# Altium schematic sheet daisy_chain_connectors.SchDoc
size A3; SheetNumber: 12; SheetTotal: 15; SheetDescription: Daisy-Chain Connectors
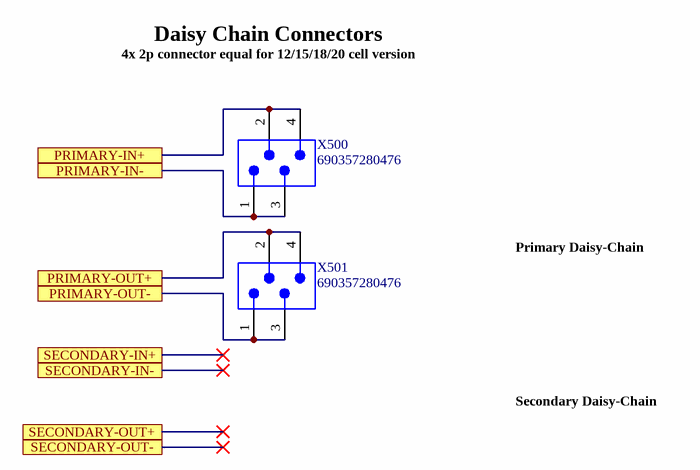
[diagram p0: daisy_chain_connectors.SchDoc]

## Parts
X500  690357280476  [690357280476]
X501  690357280476  [690357280476]

## Ports
PRIMARY-IN+, PRIMARY-IN-, PRIMARY-OUT+, PRIMARY-OUT-, SECONDARY-IN+, SECONDARY-IN-, SECONDARY-OUT+, SECONDARY-OUT-

## Nets
PRIMARY-IN+: X500.2 X500.4 ; port PRIMARY-IN+
PRIMARY-IN-: X500.1 X500.3 ; port PRIMARY-IN-
PRIMARY-OUT+: X501.2 X501.4 ; port PRIMARY-OUT+
PRIMARY-OUT-: X501.1 X501.3 ; port PRIMARY-OUT-

## Notes on the sheet
- Daisy Chain Connectors
- 4x 2p connector equal for 12/15/18/20 cell version
- Primary Daisy-Chain
- Secondary Daisy-Chain
- Fraunhofer IISB
- Schottkystr. 10
- developed by:
- 91058 Erlangen
- Germany
- Author
- Project
- License
- Description
- File
- Version
- Release Date
- Sheet
- foxbms.org <https://foxbms.org>
- www.iisb.fraunhofer.de <https://www.iisb.fraunhofer.de/>
- foxBMS Team
- /

## Library data of the parts
X500 X501 = CMP-1502-00889-2: NexarPartId: 8917647; Connector Type: Male Pin; Contact Resistance: 10mΩ; Pitch: 2.54mm; Insulation Resistance: 1GΩ; Number of Contacts: 4; Current Rating: 1.5A; Operating Supply Voltage: 100V; Gender: Male; Row Spacing: 1.4986mm; Orientation: Straight; Length: 5.91mm; RoHS: Compliant; Contact Plating: Tin; Contact Material: Bronze; Number of Positions: 4; Color: Red; Lead Pitch: 2.54mm; Number of Pins: 4; Packaging: Tape and Reel; Termination: Solder; Number of Rows: 2; REACH SVHC: Unknown; Max Operating Temperature: 105°C; Voltage Rating: 100V; Mount: Surface Mount; Fastening Type: Ramp; Min Operating Temperature: -40°C